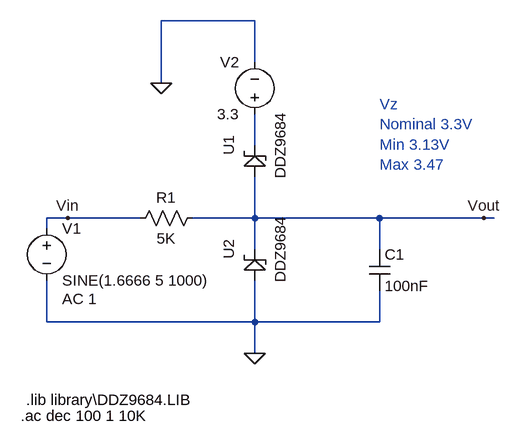
[diagram p0: schematic clampingDiodesCircuit.asc]
clampingDiodesCircuit.asc, the LTspice schematic file:
Version 4.1
SHEET 1 900 680
WIRE 448 -192 304 -192
WIRE 448 -128 448 -192
WIRE 304 -96 304 -192
WIRE 448 0 448 -48
WIRE 160 112 128 112
WIRE 272 112 160 112
WIRE 448 112 448 48
WIRE 448 112 352 112
WIRE 640 112 448 112
WIRE 800 112 640 112
WIRE 816 112 800 112
WIRE 128 128 128 112
WIRE 448 160 448 112
WIRE 640 160 640 112
WIRE 128 272 128 208
WIRE 448 272 448 208
WIRE 448 272 128 272
WIRE 640 272 640 224
WIRE 640 272 448 272
WIRE 448 320 448 272
FLAG 448 320 0
FLAG 304 -96 0
FLAG 800 112 Vout
FLAG 160 112 Vin
SYMBOL voltage 128 112 R0
WINDOW 123 24 124 Left 2
WINDOW 39 0 0 Left 0
SYMATTR Value2 AC 1
SYMATTR InstName V1
SYMATTR Value SINE(1.6666 5 1000)
SYMBOL res 368 96 R90
WINDOW 0 0 56 VBottom 2
WINDOW 3 32 56 VTop 2
SYMATTR InstName R1
SYMATTR Value 5K
SYMBOL voltage 448 -32 R180
WINDOW 0 24 96 Left 2
WINDOW 3 24 16 Left 2
WINDOW 123 0 0 Left 0
WINDOW 39 0 0 Left 0
SYMATTR InstName V2
SYMATTR Value 3.3
SYMBOL cap 624 160 R0
SYMATTR InstName C1
SYMATTR Value 100nF
SYMBOL library\\DDZ9684 448 0 R270
SYMATTR InstName U1
SYMBOL library\\DDZ9684 448 160 R270
SYMATTR InstName U2
TEXT 96 392 Left 2 !.lib library\\DDZ9684.LIB
TEXT 640 -64 Left 2 ;Vz\nNominal 3.3V\nMin 3.13V\nMax 3.47
TEXT 88 416 Left 2 !.ac dec 100 1 10K

The netlist it stands for:
* clampingDiodesCircuit.asc
V1 Vin 0 SINE(1.6666 5 1000) AC 1
R1 Vout Vin 5K
V2 N001 0 3.3
C1 Vout 0 100nF
X§U1 Vout N001 DDZ9684
X§U2 0 Vout DDZ9684
.lib library\DDZ9684.LIB
* Vz
* Nominal 3.3V
* Min 3.13V
* Max 3.47
.ac dec 100 1 10K
.lib C:\Users\Parry\Documents\BCIT-BAJA\testing\LTSPICE_SIMS\library\DDZ9684.LIB
.backanno
.end